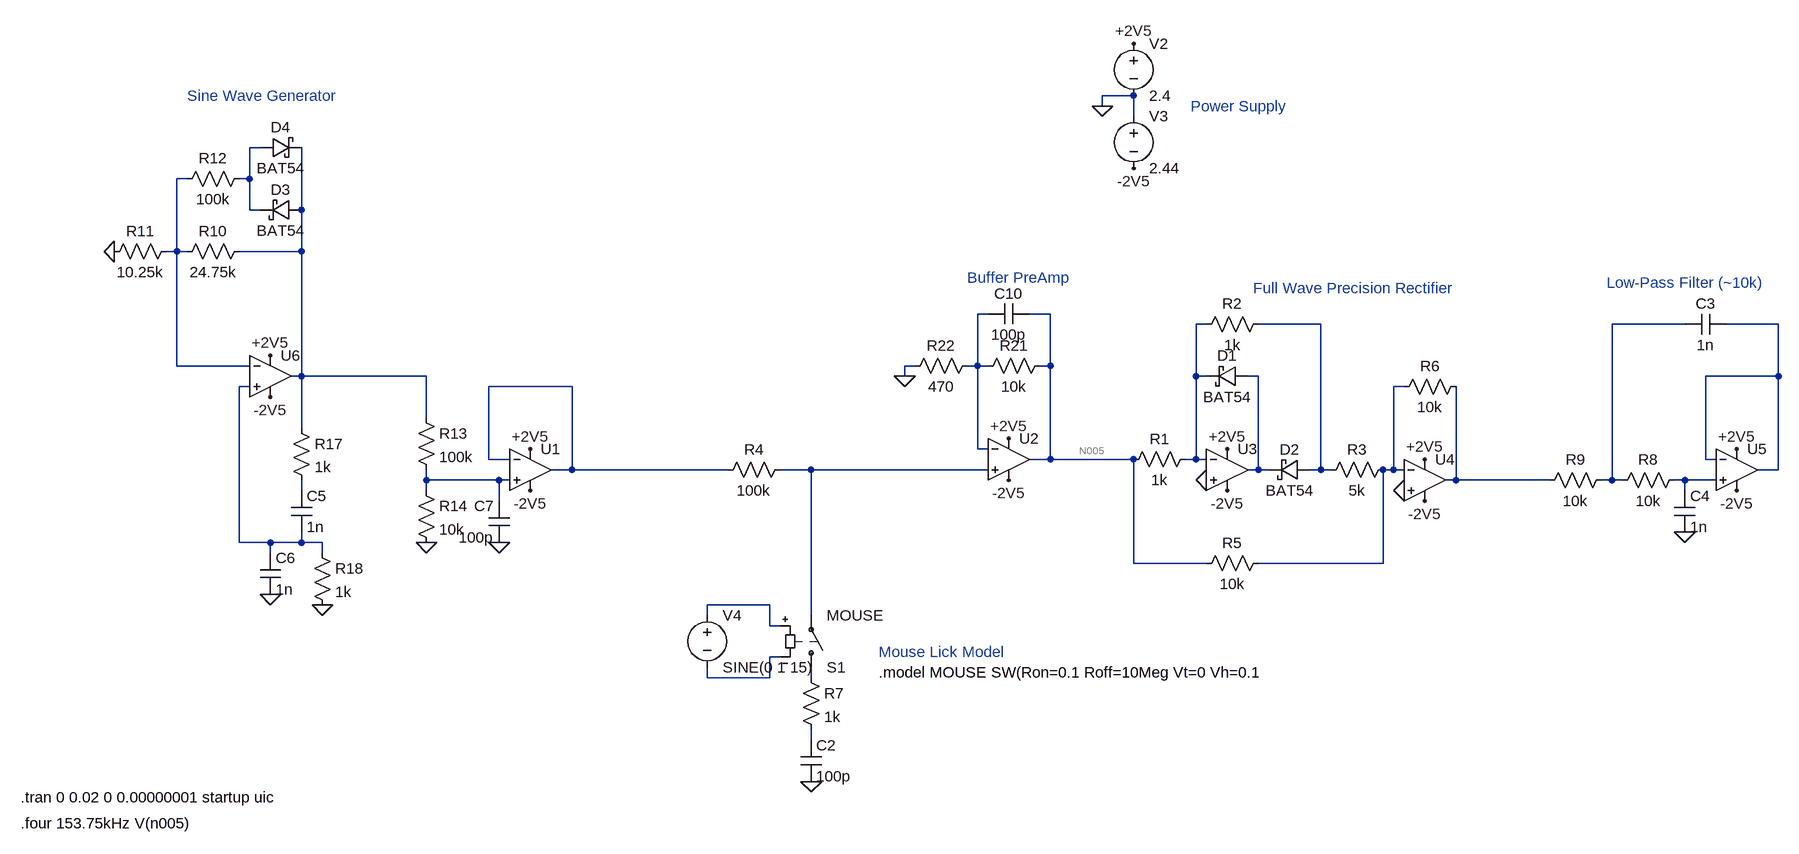
[diagram p0: schematic sim-lick-detector.asc]
sim-lick-detector.asc, the LTspice schematic file:
Version 4
SHEET 1 1840 744
WIRE 592 -496 544 -496
WIRE 544 -480 544 -496
WIRE 592 -464 592 -496
WIRE -752 -416 -768 -416
WIRE -864 -368 -880 -368
WIRE -768 -368 -768 -416
WIRE -768 -368 -784 -368
WIRE -768 -320 -768 -368
WIRE -752 -320 -768 -320
WIRE -688 -320 -688 -416
WIRE -880 -256 -880 -368
WIRE -880 -256 -896 -256
WIRE -864 -256 -880 -256
WIRE -688 -256 -688 -320
WIRE -688 -256 -784 -256
WIRE 368 -160 352 -160
WIRE 464 -160 432 -160
WIRE 704 -144 688 -144
WIRE 880 -144 784 -144
WIRE 1440 -144 1328 -144
WIRE 1584 -144 1504 -144
WIRE -880 -80 -880 -256
WIRE -768 -80 -880 -80
WIRE 256 -80 240 -80
WIRE 352 -80 352 -160
WIRE 352 -80 336 -80
WIRE 368 -80 352 -80
WIRE 464 -80 464 -160
WIRE 464 -80 448 -80
WIRE -688 -64 -688 -256
WIRE -688 -64 -704 -64
WIRE -496 -64 -688 -64
WIRE 240 -64 240 -80
WIRE 688 -64 688 -144
WIRE 704 -64 688 -64
WIRE 784 -64 768 -64
WIRE 1584 -64 1584 -144
WIRE 1584 -64 1472 -64
WIRE -768 -48 -784 -48
WIRE -272 -48 -400 -48
WIRE 1008 -48 992 -48
WIRE -496 0 -496 -64
WIRE -688 16 -688 -64
WIRE 352 48 352 -80
WIRE 368 48 352 48
WIRE -400 64 -400 -48
WIRE -368 64 -400 64
WIRE 464 64 464 -80
WIRE 464 64 432 64
WIRE 592 64 464 64
WIRE 688 64 688 -64
WIRE 688 64 672 64
WIRE 704 64 688 64
WIRE 1472 64 1472 -64
WIRE 1488 64 1472 64
WIRE -272 80 -272 -48
WIRE -272 80 -304 80
WIRE -32 80 -272 80
WIRE 96 80 48 80
WIRE 368 80 96 80
WIRE 784 80 784 -64
WIRE 784 80 768 80
WIRE 800 80 784 80
WIRE 880 80 880 -144
WIRE 880 80 864 80
WIRE 896 80 880 80
WIRE 992 80 992 -48
WIRE 992 80 976 80
WIRE 1008 80 992 80
WIRE 1584 80 1584 -64
WIRE 1584 80 1552 80
WIRE -496 96 -496 80
WIRE -384 96 -496 96
WIRE -368 96 -384 96
WIRE 1088 96 1088 -48
WIRE 1088 96 1072 96
WIRE 1232 96 1088 96
WIRE 1328 96 1328 -144
WIRE 1328 96 1312 96
WIRE 1344 96 1328 96
WIRE 1440 96 1424 96
WIRE 1488 96 1440 96
WIRE -688 112 -688 96
WIRE -496 112 -496 96
WIRE 1440 112 1440 96
WIRE -384 128 -384 96
WIRE -784 192 -784 -48
WIRE -736 192 -784 192
WIRE -688 192 -688 176
WIRE -688 192 -736 192
WIRE -656 192 -688 192
WIRE -736 208 -736 192
WIRE -656 208 -656 192
WIRE 592 224 592 64
WIRE 704 224 592 224
WIRE 976 224 976 80
WIRE 976 224 784 224
WIRE 32 288 -64 288
WIRE -64 304 -64 288
WIRE 96 304 96 80
WIRE 32 320 32 288
WIRE 48 320 32 320
WIRE 48 368 32 368
WIRE -64 400 -64 384
WIRE 32 400 32 368
WIRE 32 400 -64 400
WIRE 96 400 96 384
WIRE 96 496 96 480
FLAG 544 -480 0
FLAG 592 -576 +2V5
FLAG 592 -384 -2V5
FLAG 400 32 +2V5
FLAG 400 96 -2V5
FLAG 96 560 0
FLAG 1440 176 0
FLAG 1520 48 +2V5
FLAG 1520 112 -2V5
FLAG 736 48 +2V5
FLAG 736 112 -2V5
FLAG 704 96 0
FLAG 1040 64 +2V5
FLAG 1040 128 -2V5
FLAG 1008 112 0
FLAG -736 -96 +2V5
FLAG -736 -32 -2V5
FLAG -336 48 +2V5
FLAG -336 112 -2V5
FLAG -656 288 0
FLAG -736 272 0
FLAG 240 -64 0
FLAG -976 -256 0
FLAG -496 192 0
FLAG -384 192 0
SYMBOL voltage 592 -592 R0
WINDOW 123 0 0 Left 0
WINDOW 39 0 0 Left 0
SYMATTR InstName V2
SYMATTR Value 2.4
SYMBOL voltage 592 -480 R0
WINDOW 123 0 0 Left 0
WINDOW 39 0 0 Left 0
SYMATTR InstName V3
SYMATTR Value 2.44
SYMBOL res 64 64 R90
WINDOW 0 0 56 VBottom 2
WINDOW 3 32 56 VTop 2
SYMATTR InstName R4
SYMATTR Value 100k
SYMBOL sw 96 400 M180
SYMATTR InstName S1
SYMATTR Value MOUSE
SYMBOL res 80 384 R0
SYMATTR InstName R7
SYMATTR Value 1k
SYMBOL cap 80 496 R0
SYMATTR InstName C2
SYMATTR Value 100p
SYMBOL cap 1504 -160 R90
WINDOW 0 0 32 VBottom 2
WINDOW 3 32 32 VTop 2
SYMATTR InstName C3
SYMATTR Value 1n
SYMBOL res 1440 80 R90
WINDOW 0 0 56 VBottom 2
WINDOW 3 32 56 VTop 2
SYMATTR InstName R8
SYMATTR Value 10k
SYMBOL res 1328 80 R90
WINDOW 0 0 56 VBottom 2
WINDOW 3 32 56 VTop 2
SYMATTR InstName R9
SYMATTR Value 10k
SYMBOL cap 1424 112 R0
SYMATTR InstName C4
SYMATTR Value 1n
SYMBOL voltage -64 288 R0
WINDOW 123 0 0 Left 0
WINDOW 39 0 0 Left 0
SYMATTR InstName V4
SYMATTR Value SINE(0 1 15)
SYMBOL schottky 768 -80 R90
WINDOW 0 0 32 VBottom 2
WINDOW 3 32 32 VTop 2
SYMATTR InstName D1
SYMATTR Value BAT54
SYMATTR Description Diode
SYMATTR Type diode
SYMBOL schottky 864 64 R90
WINDOW 0 0 32 VBottom 2
WINDOW 3 32 32 VTop 2
SYMATTR InstName D2
SYMATTR Value BAT54
SYMATTR Description Diode
SYMATTR Type diode
SYMBOL res 688 48 R90
WINDOW 0 0 56 VBottom 2
WINDOW 3 32 56 VTop 2
SYMATTR InstName R1
SYMATTR Value 1k
SYMBOL res 800 -160 R90
WINDOW 0 0 56 VBottom 2
WINDOW 3 32 56 VTop 2
SYMATTR InstName R2
SYMATTR Value 1k
SYMBOL res 992 64 R90
WINDOW 0 0 56 VBottom 2
WINDOW 3 32 56 VTop 2
SYMATTR InstName R3
SYMATTR Value 5k
SYMBOL res 800 208 R90
WINDOW 0 0 56 VBottom 2
WINDOW 3 32 56 VTop 2
SYMATTR InstName R5
SYMATTR Value 10k
SYMBOL res 1104 -64 R90
WINDOW 0 0 56 VBottom 2
WINDOW 3 32 56 VTop 2
SYMATTR InstName R6
SYMATTR Value 10k
SYMBOL res -704 0 R0
SYMATTR InstName R17
SYMATTR Value 1k
SYMBOL cap -704 112 R0
SYMATTR InstName C5
SYMATTR Value 1n
SYMBOL cap -752 208 R0
SYMATTR InstName C6
SYMATTR Value 1n
SYMBOL res -672 192 R0
SYMATTR InstName R18
SYMATTR Value 1k
SYMBOL res 464 -96 R90
WINDOW 0 0 56 VBottom 2
WINDOW 3 32 56 VTop 2
SYMATTR InstName R21
SYMATTR Value 10k
SYMBOL res 352 -96 R90
WINDOW 0 0 56 VBottom 2
WINDOW 3 32 56 VTop 2
SYMATTR InstName R22
SYMATTR Value 470
SYMBOL OpAmps\\UniversalOpAmp -336 80 R0
SYMATTR InstName U1
SYMATTR Value2 Avol=1Meg GBW=50Meg Vos=100u
SYMATTR SpiceLine En=4.5n Enk=1k In=4f Ink=0.1 Rin=10T
SYMBOL OpAmps\\UniversalOpAmp 400 64 R0
SYMATTR InstName U2
SYMATTR Value2 Avol=1Meg GBW=50Meg Vos=100u
SYMATTR SpiceLine En=4.5n Enk=1k In=4f Ink=0.1 Rin=10T
SYMBOL OpAmps\\UniversalOpAmp 736 80 R0
SYMATTR InstName U3
SYMATTR Value2 Avol=1Meg GBW=50Meg Vos=100u
SYMATTR SpiceLine En=4.5n Enk=1k In=4f Ink=0.1 Rin=10T
SYMBOL OpAmps\\UniversalOpAmp 1040 96 R0
SYMATTR InstName U4
SYMATTR Value2 Avol=1Meg GBW=50Meg Vos=100u
SYMATTR SpiceLine En=4.5n Enk=1k In=4f Ink=0.1 Rin=10T
SYMBOL OpAmps\\UniversalOpAmp 1520 80 R0
SYMATTR InstName U5
SYMATTR Value2 Avol=1Meg GBW=50Meg Vos=100u
SYMATTR SpiceLine En=4.5n Enk=1k In=4f Ink=0.1 Rin=10T
SYMBOL schottky -688 -336 R90
WINDOW 0 0 32 VBottom 2
WINDOW 3 32 32 VTop 2
SYMATTR InstName D3
SYMATTR Value BAT54
SYMATTR Description Diode
SYMATTR Type diode
SYMBOL schottky -752 -400 R270
WINDOW 0 32 32 VTop 2
WINDOW 3 0 32 VBottom 2
SYMATTR InstName D4
SYMATTR Value BAT54
SYMATTR Description Diode
SYMATTR Type diode
SYMBOL res -768 -272 R90
WINDOW 0 0 56 VBottom 2
WINDOW 3 32 56 VTop 2
SYMATTR InstName R10
SYMATTR Value 24.75k
SYMBOL res -880 -272 R90
WINDOW 0 0 56 VBottom 2
WINDOW 3 32 56 VTop 2
SYMATTR InstName R11
SYMATTR Value 10.25k
SYMBOL res -768 -384 R90
WINDOW 0 0 56 VBottom 2
WINDOW 3 32 56 VTop 2
SYMATTR InstName R12
SYMATTR Value 100k
SYMBOL OpAmps\\UniversalOpAmp2 -736 -64 R0
SYMATTR InstName U6
SYMATTR Value2 Avol=1Meg GBW=50Meg Slew=10Meg
SYMATTR SpiceLine Ilimit=25m Rail=0 Vos=100u
SYMATTR SpiceLine2 En=4.5n Enk=1k In=4f Ink=0.1 Rin=10T
SYMBOL res -512 -16 R0
SYMATTR InstName R13
SYMATTR Value 100k
SYMBOL res -512 96 R0
SYMATTR InstName R14
SYMATTR Value 10k
SYMBOL cap -368 192 R180
WINDOW 0 24 56 Left 2
WINDOW 3 24 8 Left 2
SYMATTR InstName C7
SYMATTR Value 100p
SYMBOL cap 368 -144 R270
WINDOW 0 32 32 VTop 2
WINDOW 3 0 32 VBottom 2
SYMATTR InstName C10
SYMATTR Value 100p
TEXT 336 -216 Left 2 ;Buffer PreAmp
TEXT 1320 -208 Left 2 ;Low-Pass Filter (~10k)
TEXT 680 -480 Left 2 ;Power Supply
TEXT 200 360 Left 2 ;Mouse Lick Model
TEXT -864 -496 Left 2 ;Sine Wave Generator
TEXT 200 392 Left 2 !.model MOUSE SW(Ron=0.1 Roff=10Meg Vt=0 Vh=0.1
TEXT 776 -200 Left 2 ;Full Wave Precision Rectifier
TEXT -1120 584 Left 2 !.tran 0 0.02 0 0.00000001 startup uic
TEXT -1120 624 Left 2 !.four 153.75kHz V(n005)

The netlist it stands for:
* sim-lick-detector.asc
V2 +2V5 0 2.4
V3 0 -2V5 2.44
R4 N014 N012 100k
S1 N021 N014 N019 N020 MOUSE
R7 N021 N022 1k
C2 N022 0 100p
C3 N009 N008 1n
R8 N017 N008 10k
R9 N008 N016 10k
C4 N017 0 1n
V4 N019 N020 SINE(0 1 15)
D1 N010 N006 BAT54
D2 N007 N010 BAT54
R1 N006 N005 1k
R2 N007 N006 1k
R3 N013 N007 5k
R5 N013 N005 10k
R6 N016 N013 10k
R17 N003 N018 1k
C5 N018 N011 1n
C6 N011 0 1n
R18 N011 0 1k
R21 N005 N004 10k
R22 N004 0 470
XU1 N015 N012 +2V5 -2V5 N012 level1 Avol=1Meg GBW=50Meg Vos=100u En=4.5n Enk=1k In=4f Ink=0.1 Rin=10T  ; pins In+ In- V+ V- OUT
XU2 N014 N004 +2V5 -2V5 N005 level1 Avol=1Meg GBW=50Meg Vos=100u En=4.5n Enk=1k In=4f Ink=0.1 Rin=10T  ; pins In+ In- V+ V- OUT
XU3 0 N006 +2V5 -2V5 N010 level1 Avol=1Meg GBW=50Meg Vos=100u En=4.5n Enk=1k In=4f Ink=0.1 Rin=10T  ; pins In+ In- V+ V- OUT
XU4 0 N013 +2V5 -2V5 N016 level1 Avol=1Meg GBW=50Meg Vos=100u En=4.5n Enk=1k In=4f Ink=0.1 Rin=10T  ; pins In+ In- V+ V- OUT
XU5 N017 N009 +2V5 -2V5 N009 level1 Avol=1Meg GBW=50Meg Vos=100u En=4.5n Enk=1k In=4f Ink=0.1 Rin=10T  ; pins In+ In- V+ V- OUT
D3 N003 N001 BAT54
D4 N001 N003 BAT54
R10 N003 N002 24.75k
R11 N002 0 10.25k
R12 N001 N002 100k
XU6 N011 N002 +2V5 -2V5 N003 level2 Avol=1Meg GBW=50Meg Slew=10Meg Ilimit=25m Rail=0 Vos=100u En=4.5n Enk=1k In=4f Ink=0.1 Rin=10T  ; pins In+ In- V+ V- OUT
R13 N003 N015 100k
R14 N015 0 10k
C7 0 N015 100p
C10 N004 N005 100p
.model D D
.lib standard.dio
* Buffer PreAmp
* Low-Pass Filter (~10k)
* Power Supply
* Mouse Lick Model
* Sine Wave Generator
.model MOUSE SW(Ron=0.1 Roff=10Meg Vt=0 Vh=0.1
* Full Wave Precision Rectifier
.tran 0 0.02 0 0.00000001 startup uic
.four 153.75kHz V(n005)
.lib UniversalOpAmp1.lib
.lib UniversalOpAmp2.lib
.backanno
.end